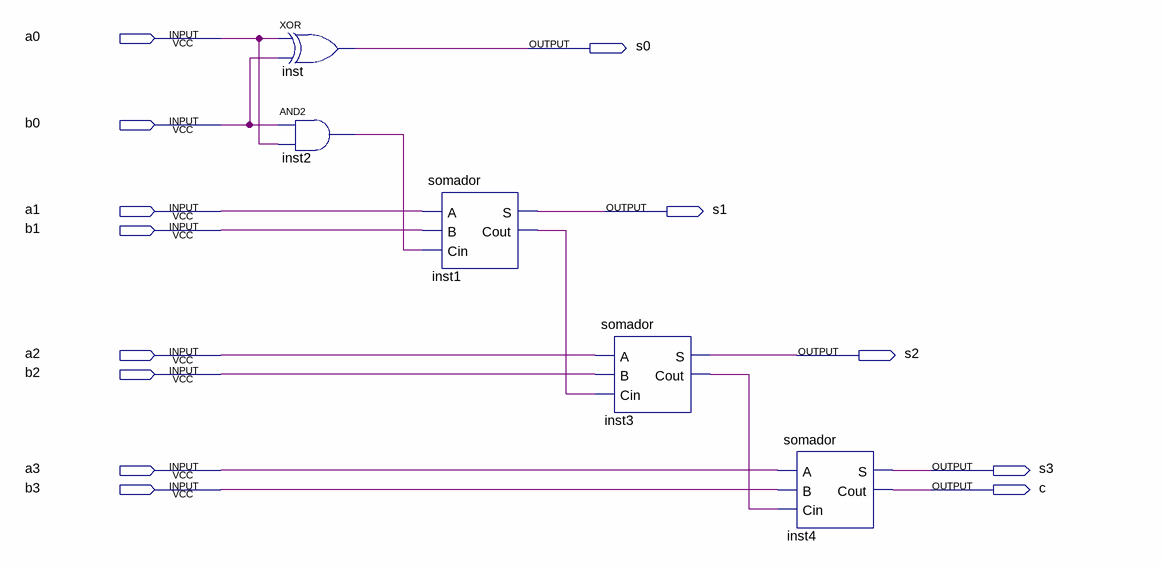
[diagram p0: schematic sheet]
// Quartus schematic somadortotal.bdf as structural Verilog: 5 symbols, 13 pins
module somadortotal (
  input  a0,
  input  b0,
  input  a1,
  input  b1,
  input  a2,
  input  b2,
  input  a3,
  input  b3,
  output s0,
  output s1,
  output s2,
  output s3,
  output c
);

  wire inst1_cout, inst2_out, inst3_cout;

  xor inst (s0, a0, b0);
  and inst2 (inst2_out, b0, a0);
  somador inst1 (.A(a1), .B(b1), .Cin(inst2_out), .S(s1), .Cout(inst1_cout));
  somador inst3 (.A(a2), .B(b2), .Cin(inst1_cout), .S(s2), .Cout(inst3_cout));
  somador inst4 (.A(a3), .B(b3), .Cin(inst3_cout), .S(s3), .Cout(c));
endmodule
